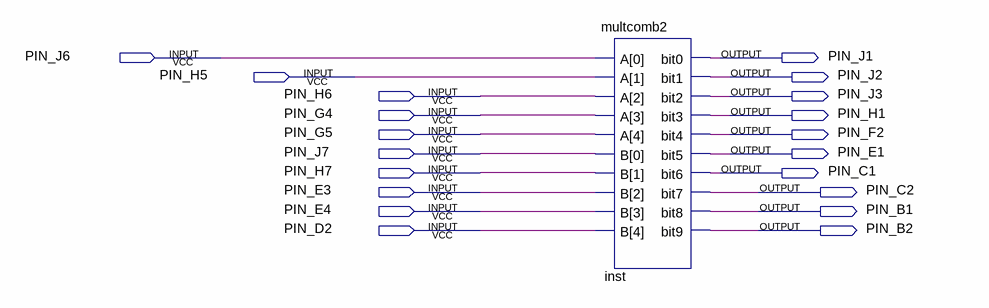
[diagram p0: schematic sheet]
// Quartus schematic mult-comb-final.bdf as structural Verilog: 1 symbols, 20 pins
module \mult-comb-final  (
  input  PIN_J6,
  input  PIN_H5,
  input  PIN_H6,
  input  PIN_G4,
  input  PIN_G5,
  input  PIN_J7,
  input  PIN_H7,
  input  PIN_E3,
  input  PIN_E4,
  input  PIN_D2,
  output PIN_J1,
  output PIN_J2,
  output PIN_J3,
  output PIN_H1,
  output PIN_F2,
  output PIN_E1,
  output PIN_C1,
  output PIN_C2,
  output PIN_B1,
  output PIN_B2
);

  multcomb2 inst (
    .A({PIN_G5, PIN_G4, PIN_H6, PIN_H5, PIN_J6}), .B({PIN_D2, PIN_E4, PIN_E3, PIN_H7, PIN_J7}),
    .bit0(PIN_J1), .bit1(PIN_J2), .bit2(PIN_J3), .bit3(PIN_H1), .bit4(PIN_F2), .bit5(PIN_E1), .bit6(PIN_C1),
    .bit7(PIN_C2), .bit8(PIN_B1), .bit9(PIN_B2));
endmodule
